# EAGLE design openLRSngRX32 (EAGLE 6.4)
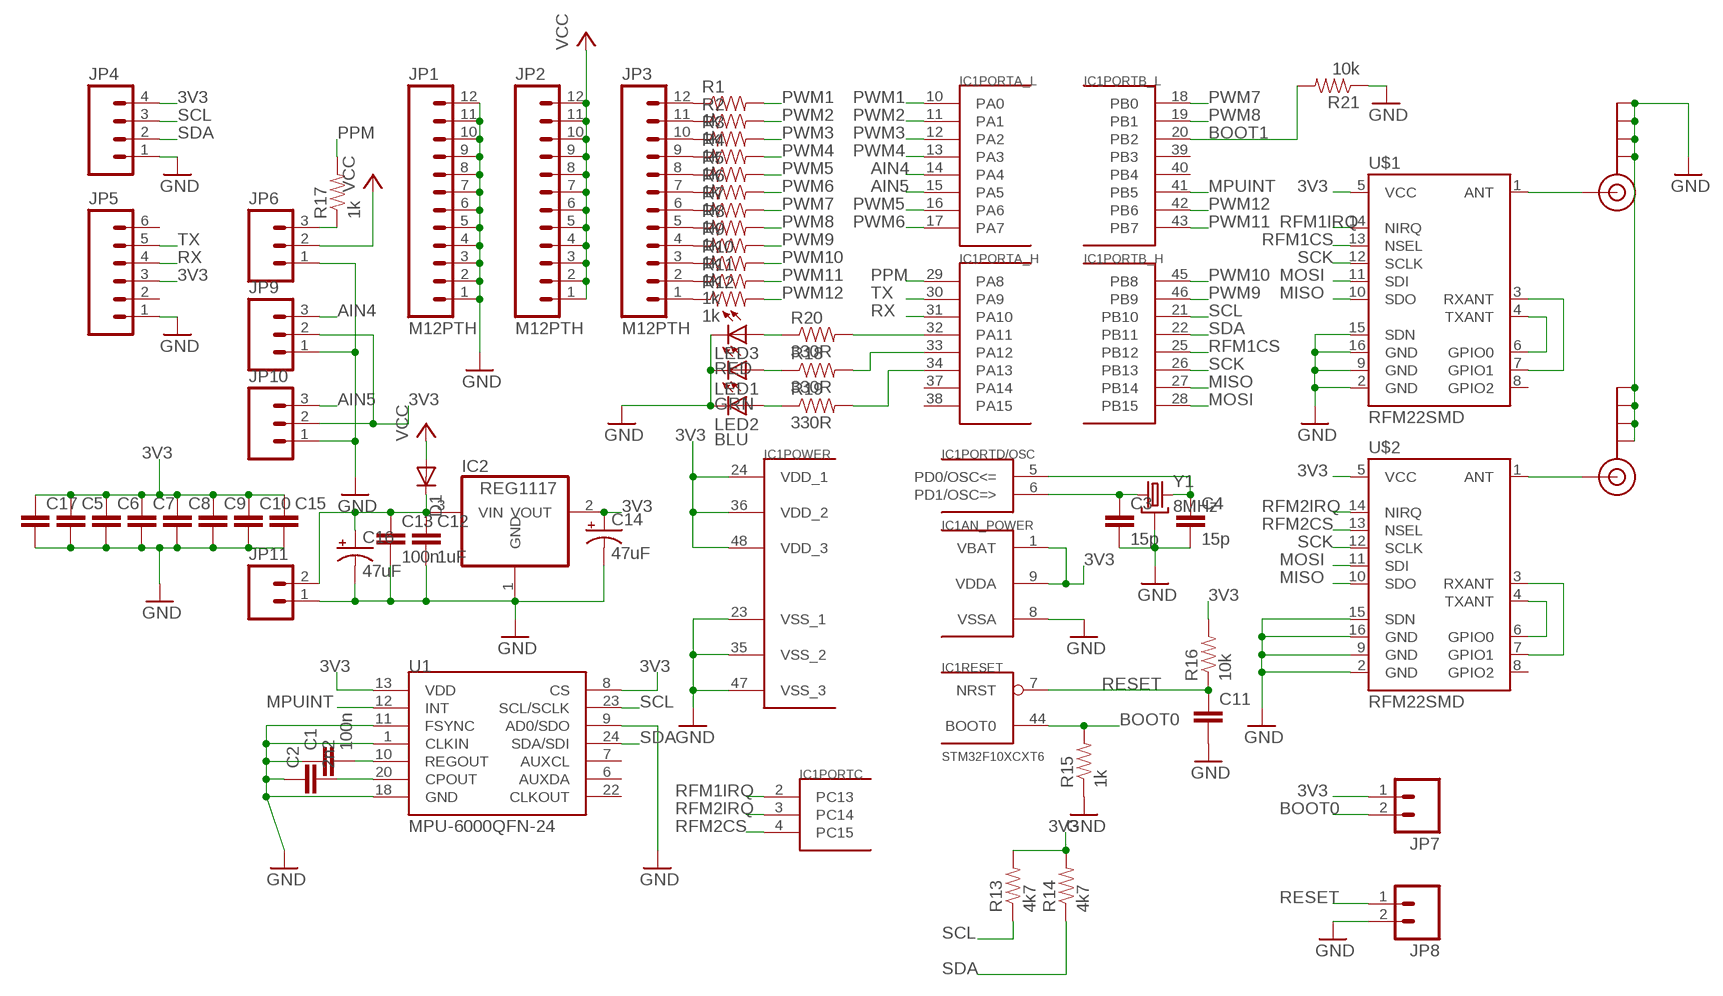
[diagram p0: schematic, sheet 1]

## Parts
C1  100n  CAP0805  [0805]
C2  2n2  CAP0805  [0805]
C3  15p  CAP0805  [0805]
C4  15p  CAP0805  [0805]
C5  CAP0805  [0805]
C6  CAP0805  [0805]
C7  CAP0805  [0805]
C8  CAP0805  [0805]
C9  CAP0805  [0805]
C10  CAP0805  [0805]
C11  CAP0805  [0805]
C12  1uF  CAP0805  [0805]
C13  100n  CAP0805  [0805]
C14  47uF  47UF-TANT  [EIA3528]
C15  CAP0805  [0805]
C16  47uF  47UF-TANT  [EIA3528]
C17  CAP0805  [0805]
D1  DIODE-DO-214AC  [DO-214AC]
IC1  STM32F10XCXT6  [TQFP48]
IC2  REG1117  [SOT223]
J$1  SMA_EDGE  [SMA-EDGE]
J$2  SMA_EDGE  [SMA-EDGE]
JP1  M12PTH  [1X12]
JP2  M12PTH  [1X12]
JP3  M12PTH  [1X12]
JP4  M04PTH  [1X04]
JP5  M06SIP  [1X06]
JP6  M03PTH  [1X03]
JP7  M02PTH  [1X02]
JP8  M02PTH  [1X02]
JP9  M03PTH  [1X03]
JP10  M03PTH  [1X03]
JP11  M02PTH  [1X02]
LED1  GRN  LEDSML0805  [SML0805]
LED2  BLU  LEDSML0805  [SML0805]
LED3  RED  LEDSML0805  [SML0805]
R1  1k  RESISTOR0805-RES  [0805]
R2  1k  RESISTOR0805-RES  [0805]
R3  1k  RESISTOR0805-RES  [0805]
R4  1k  RESISTOR0805-RES  [0805]
R5  1k  RESISTOR0805-RES  [0805]
R6  1k  RESISTOR0805-RES  [0805]
R7  1k  RESISTOR0805-RES  [0805]
R8  1k  RESISTOR0805-RES  [0805]
R9  1k  RESISTOR0805-RES  [0805]
R10  1k  RESISTOR0805-RES  [0805]
R11  1k  RESISTOR0805-RES  [0805]
R12  1k  RESISTOR0805-RES  [0805]
R13  4k7  RESISTOR0805-RES  [0805]
R14  4k7  RESISTOR0805-RES  [0805]
R15  1k  RESISTOR0805-RES  [0805]
R16  10k  RESISTOR0805-RES  [0805]
R17  1k  RESISTOR0805-RES  [0805]
R18  330R  RESISTOR0805-RES  [0805]
R19  330R  RESISTOR0805-RES  [0805]
R20  330R  RESISTOR0805-RES  [0805]
R21  10k  RESISTOR0805-RES  [0805]
U1  MPU-6000QFN-24  [QFN-24-TESTING]
U$1  RFM22SMD  [RFM22-XXX-S2]
U$2  RFM22SMD  [RFM22-XXX-S2]
Y1  8MHz  CRYSTAL3.2X2.5  [CRYSTAL-SMD-5X3]

## Nets
3V3: C5.1 C6.1 C7.1 C8.1 C9.1 C10.1 C14.A(+) C15.1 C17.1 IC1.1(AN_POWER:VBAT) IC1.9(AN_POWER:VDDA) IC1.24(POWER:VDD_1) IC1.36(POWER:VDD_2) IC1.48(POWER:VDD_3) IC2.2(VOUT) JP4.4 JP5.3 JP7.1 JP9.2 JP10.2 R13.2 R14.2 R16.2 U1.8(CS) U1.13(VDD) U$1.5(VCC) U$2.5(VCC)
AIN4: IC1.14(PORTA_L:PA4) JP9.3
AIN5: IC1.15(PORTA_L:PA5) JP10.3
BOOT0: IC1.44(RESET:BOOT0) JP7.2 R15.2
BOOT1: IC1.20(PORTB_L:PB2) R21.2
GND: C1.1 C2.1 C3.2 C4.2 C5.2 C6.2 C7.2 C8.2 C9.2 C10.2 C11.2 C12.2 C13.2 C14.C(-) C15.2 C16.C(-) C17.2 IC1.8(AN_POWER:VSSA) IC1.23(POWER:VSS_1) IC1.35(POWER:VSS_2) IC1.47(POWER:VSS_3) IC2.1(GND) J$1.GND@0(GND) J$1.GND@1(GND) J$1.GND@2(GND) J$1.GND@3(GND) J$2.GND@0(GND) J$2.GND@1(GND) J$2.GND@2(GND) J$2.GND@3(GND) JP1.1 JP1.2 JP1.3 JP1.4 JP1.5 JP1.6 JP1.7 JP1.8 JP1.9 JP1.10 JP1.11 JP1.12 JP4.1 JP5.1 JP6.1 JP8.2 JP9.1 JP10.1 JP11.1 LED1.C LED2.C LED3.C R15.1 R21.1 U1.1(CLKIN) U1.9(AD0/SDO) U1.11(FSYNC) U1.18(GND) U$1.2(GND) U$1.9(GND) U$1.15(SDN) U$1.16(GND) U$2.2(GND) U$2.9(GND) U$2.15(SDN) U$2.16(GND) Y1.2(GND) Y1.4(GND)
MISO: IC1.27(PORTB_H:PB14) U$1.10(SDO) U$2.10(SDO)
MOSI: IC1.28(PORTB_H:PB15) U$1.11(SDI) U$2.11(SDI)
MPUINT: IC1.41(PORTB_L:PB5) U1.12(INT)
N$1: JP3.12 R1.1
N$2: JP3.11 R2.1
N$3: JP3.10 R3.1
N$4: JP3.9 R4.1
N$5: JP3.8 R5.1
N$6: JP3.7 R6.1
N$7: JP3.6 R7.1
N$8: JP3.5 R8.1
N$9: JP3.4 R9.1
N$10: JP3.3 R10.1
N$11: JP3.2 R11.1
N$12: JP3.1 R12.1
N$13: J$2.SIG(SIGNAL) U$2.1(ANT)
N$14: C1.2 U1.10(REGOUT)
N$15: C2.2 U1.20(CPOUT)
N$16: C4.1 IC1.5(PORTD/OSC:PD0/OSC<=) Y1.3
N$17: C3.1 IC1.6(PORTD/OSC:PD1/OSC=>) Y1.1
N$18: J$1.SIG(SIGNAL) U$1.1(ANT)
N$19: U$2.4(TXANT) U$2.6(GPIO0)
N$20: U$2.3(RXANT) U$2.7(GPIO1)
N$23: U$1.4(TXANT) U$1.6(GPIO0)
N$24: U$1.3(RXANT) U$1.7(GPIO1)
N$25: JP6.3 R17.1
N$28: C12.1 C13.1 C16.A(+) D1.C IC2.3(VIN) JP11.2
N$30: LED3.A R20.1
N$31: LED1.A R18.1
N$32: LED2.A R19.1
N$33: IC1.32(PORTA_H:PA11) R20.2
N$34: IC1.33(PORTA_H:PA12) R18.2
N$35: IC1.34(PORTA_H:PA13) R19.2
PPM: IC1.29(PORTA_H:PA8) R17.2
PWM1: IC1.10(PORTA_L:PA0) R1.2
PWM2: IC1.11(PORTA_L:PA1) R2.2
PWM3: IC1.12(PORTA_L:PA2) R3.2
PWM4: IC1.13(PORTA_L:PA3) R4.2
PWM5: IC1.16(PORTA_L:PA6) R5.2
PWM6: IC1.17(PORTA_L:PA7) R6.2
PWM7: IC1.18(PORTB_L:PB0) R7.2
PWM8: IC1.19(PORTB_L:PB1) R8.2
PWM9: IC1.46(PORTB_H:PB9) R9.2
PWM10: IC1.45(PORTB_H:PB8) R10.2
PWM11: IC1.43(PORTB_L:PB7) R11.2
PWM12: IC1.42(PORTB_L:PB6) R12.2
RESET: C11.1 IC1.7(RESET:NRST) JP8.1 R16.1
RFM1CS: IC1.25(PORTB_H:PB12) U$1.13(NSEL)
RFM1IRQ: IC1.2(PORTC:PC13) U$1.14(NIRQ)
RFM2CS: IC1.4(PORTC:PC15) U$2.13(NSEL)
RFM2IRQ: IC1.3(PORTC:PC14) U$2.14(NIRQ)
RX: IC1.31(PORTA_H:PA10) JP5.4
SCK: IC1.26(PORTB_H:PB13) U$1.12(SCLK) U$2.12(SCLK)
SCL: IC1.21(PORTB_H:PB10) JP4.3 R13.1 U1.23(SCL/SCLK)
SDA: IC1.22(PORTB_H:PB11) JP4.2 R14.1 U1.24(SDA/SDI)
TX: IC1.30(PORTA_H:PA9) JP5.5
VCC: D1.A JP2.1 JP2.2 JP2.3 JP2.4 JP2.5 JP2.6 JP2.7 JP2.8 JP2.9 JP2.10 JP2.11 JP2.12 JP6.2
Unconnected: IC1.37(PORTA_H:PA14) IC1.38(PORTA_H:PA15) IC1.39(PORTB_L:PB3) IC1.40(PORTB_L:PB4) JP5.2 JP5.6 U1.6(AUXDA) U1.7(AUXCL) U1.22(CLKOUT) U$1.8(GPIO2) U$2.8(GPIO2)

## Library data of the parts
C1-C13 C15 C17 = SparkFun-Capacitors:CAP: Capacitor Standard 0603 ceramic capacitor, and 0.1" leaded capacitor.
C14 C16 = SparkFun-Capacitors:47UF-TANT: 47uF Tantalum SMT CAP-08310- 10V 10% (EIA-3528); PROD_ID: CAP-08310
D1 = diode:DIODE-: DIODE
IC1 = stm32:STM32F10XCXT6: ST STM32F101/103 48pin LQFP
IC2 = burr-brown:REG1117: 800mA and 1A Low Dropout (LDO) Positive Regulator 1.8V, 2.5V, 2.85V, 3.3V, 5V, and Adj; MPN: REG1117; OC_FARNELL: 1097566; OC_NEWARK: 14P6981
J$1 J$2 = SparkFun-Connectors:SMA_EDGE: SMA Antenna Connector End launch SMA connector. The paste layer has been removed so that the connector can be hand soldered onto the board after reflow.
JP1-JP3 = SparkFun-Connectors:M12: Header 12 Standard 12-pin 0.1" header. Use with straight break away headers (SKU : PRT-00116), right angle break away headers (PRT-00553), swiss pins (PRT-00743), machine pins (PRT-00117), and female headers (PRT-00115).
JP4 = SparkFun-Connectors:M04: Header 4 Standard 4-pin 0.1" header. Use with straight break away headers (SKU : PRT-00116), right angle break away headers (PRT-00553), swiss pins (PRT-00743), machine pins (PRT-00117), and female headers (PRT-00115). Molex polarized connector foot print use with SKU : PRT-08231 with associated crimp pins and housings. 1MM SMD Version SKU: PRT-10208
JP5 = SparkFun-Connectors:M06: Header 6 Standard 6-pin 0.1" header. Use with straight break away headers (SKU : PRT-00116), right angle break away headers (PRT-00553), swiss pins (PRT-00743), machine pins (PRT-00117), and female headers (PRT-00115). Molex polarized connector foot print use with SKU : PRT-08094 with associated crimp pins and housings. NOTES ON THE VARIANTS LOCK and LOCK_LONGPADS... This footprint was designed to help hold the alignment of a through-hole component (i.e. 6-pin header) while soldering it into place. You may notice that each hole has been shifted either up or down by 0.005 of an inch from it's more standard position (which is a perfectly straight line). This slight alteration caused the pins (the squares in the middle) to touch the edges of the holes. Because they are alternating, it causes a "brace" to hold the component in place. 0.005 has proven to be the perfect amount of "off-center" position when using our standard breakaway headers. Although looks a little odd when you look at the bare footprint, once you have a header in there, the alteration is very hard to notice. Also, if you push a header all the way into place, it is covered up entirely on the bottom side. This idea of altering the position of holes to aid alignment will be further integrated into the Sparkfun Library for other footprints. It can help hold any component with 3 or more connection pins.
JP6 JP9 JP10 = SparkFun-Connectors:M03: Header 3 Standard 3-pin 0.1" header. Use with straight break away headers (SKU : PRT-00116), right angle break away headers (PRT-00553), swiss pins (PRT-00743), machine pins (PRT-00117), and female headers (PRT-00115). Molex polarized connector foot print use with SKU : PRT-08232 with associated crimp pins and housings.
JP7 JP8 JP11 = SparkFun-Connectors:M02: Header 2 Standard 2-pin 0.1" header. Use with straight break away headers (SKU : PRT-00116), right angle break away headers (PRT-00553), swiss pins (PRT-00743), machine pins (PRT-00117), and female headers (PRT-00115). Molex polarized connector foot print use with SKU : PRT-08233 with associated crimp pins and housings.
LED1-LED3 = led:LED: LED OSRAM: - CHIPLED LG R971, LG N971, LY N971, LG Q971, LY Q971, LO R971, LY R971 LH N974, LH R974 LS Q976, LO Q976, LY Q976 LO Q996 - Hyper CHIPLED LW Q18S LB Q993, LB Q99A, LB R99A - SideLED LS A670, LO A670, LY A670, LG A670, LP A670 LB A673, LV A673, LT A673, LW A673 LH A674 LY A675 LS A676, LA A676, LO A676, LY A676, LW A676 LS A679, LY A679, LG A679 - Hyper Micro SIDELED® LS Y876, LA Y876, LO Y876, LY Y876 LT Y87S - SmartLED LW L88C, LW L88S LB L89C, LB L89S, LG L890 LS L89K, LO L89K, LY L89K LS L896, LA L896, LO L896, LY L896 - TOPLED LS T670, LO T670, LY T670, LG T670, LP T670 LSG T670, LSP T670, LSY T670, LOP T670, LYG T670 LG T671, LOG T671, LSG T671 LB T673, LV T673, LT T673, LW T673 LH T674 LS T676, LA T676, LO T676, LY T676, LB T676, LH T676, LSB T676, LW T676 LB T67C, LV T67C, LT T67C, LS T67K, LO T67K, LY T67K, LW E67C LS E67B, LA E67B, LO E67B, LY E67B, LB E67C, LV E67C, LT E67C LW T67C LS T679, LY T679, LG T679 LS T770, LO T770, LY T770, LG T770, LP T770 LB T773, LV T773, LT T773, LW T773 LH T774 LS E675, LA E675, LY E675, LS T675 LS T776, LA T776, LO T776, LY T776, LB T776 LHGB T686 LT T68C, LB T68C - Hyper Mini TOPLED® LB M676 - Mini TOPLED Santana® LG M470 LS M47K, LO M47K, LY M47K Source: http://www.osram.convergy.de LUXEON: - LUMILED® LXK2-PW12-R00, LXK2-PW12-S00, LXK2-PW14-U00, LXK2-PW14-V00 LXK2-PM12-R00, LXK2-PM12-S00, LXK2-PM14-U00 LXK2-PE12-Q00, LXK2-PE12-R00, LXK2-PE12-S00, LXK2-PE14-T00, LXK2-PE14-U00 LXK2-PB12-K00, LXK2-PB12-L00, LXK2-PB12-M00, LXK2-PB14-N00, LXK2-PB14-P00, LXK2-PB14-Q00 LXK2-PR12-L00, LXK2-PR12-M00, LXK2-PR14-Q00, LXK2-PR14-R00 LXK2-PD12-Q00, LXK2-PD12-R00, LXK2-PD12-S00 LXK2-PH12-R00, LXK2-PH12-S00 LXK2-PL12-P00, LXK2-PL12-Q00, LXK2-PL12-R00 Source: www.luxeon.com KINGBRIGHT: KA-3528ASYC Source: www.kingbright.com
R1-R21 = SparkFun-Resistors:RESISTOR: Resistor Basic schematic elements and footprints for 0603, 1206, and PTH resistors.
U1 = SparkFun-Sensors:MPU-6000: MPU-6000 - I2C address is 0x68 with AD0 low and 0x69 with AD0 high.
U$1 U$2 = SparkFun-RF:RFM22: The RFM22 is a low-power, low cost radio that is capable of operating in the 434MHz and 900MHz open bands. It's frequency is software defined and there are some very good libraries written for it.
Y1 = crystal_3225:CRYSTAL: Various standard crystals. Proven footprints. Spark Fun Electronics SKU : COM-00534

## Board
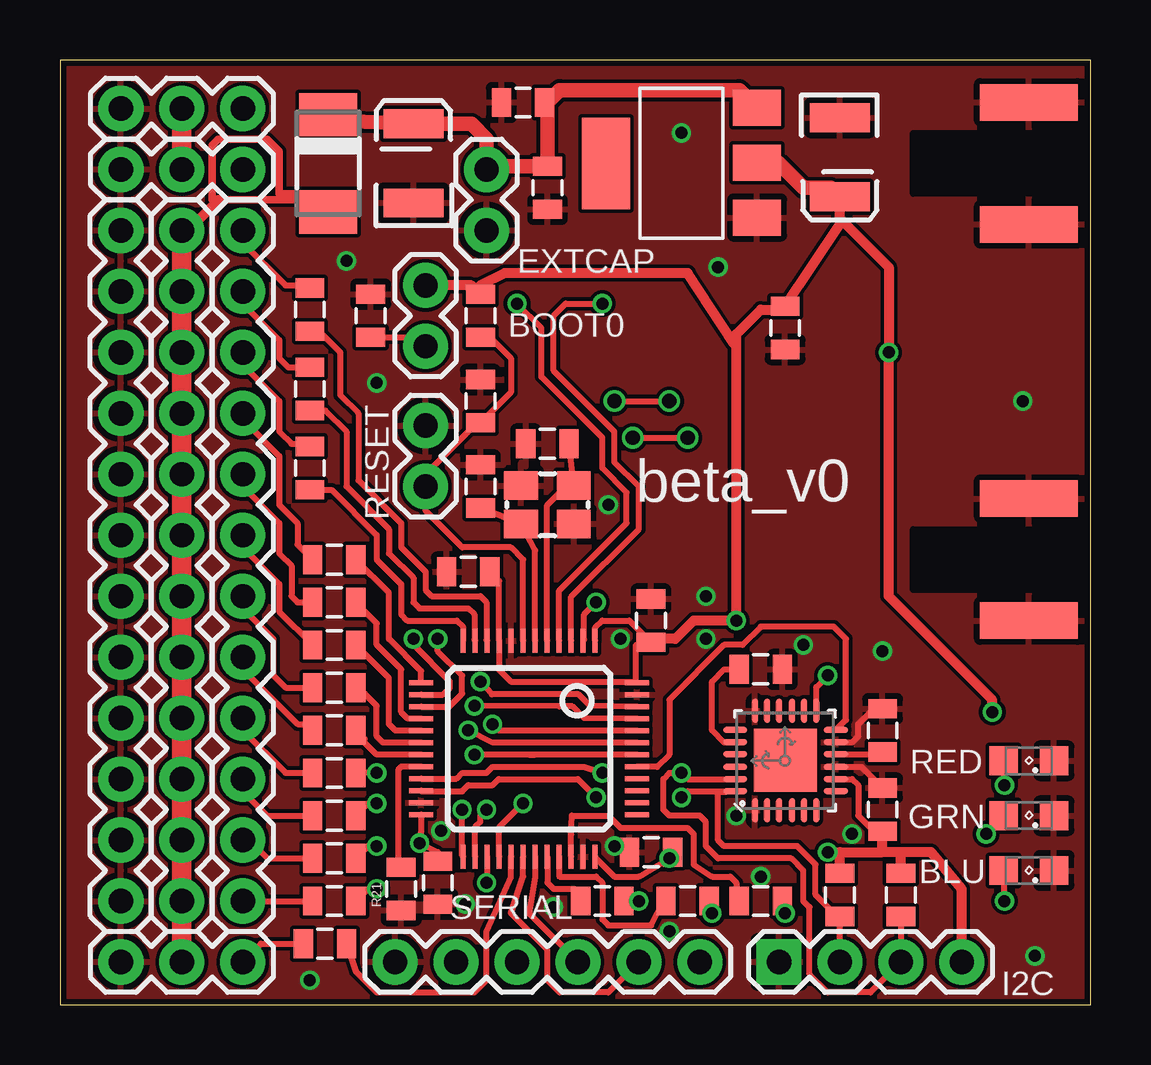
[diagram p1: board, top side]
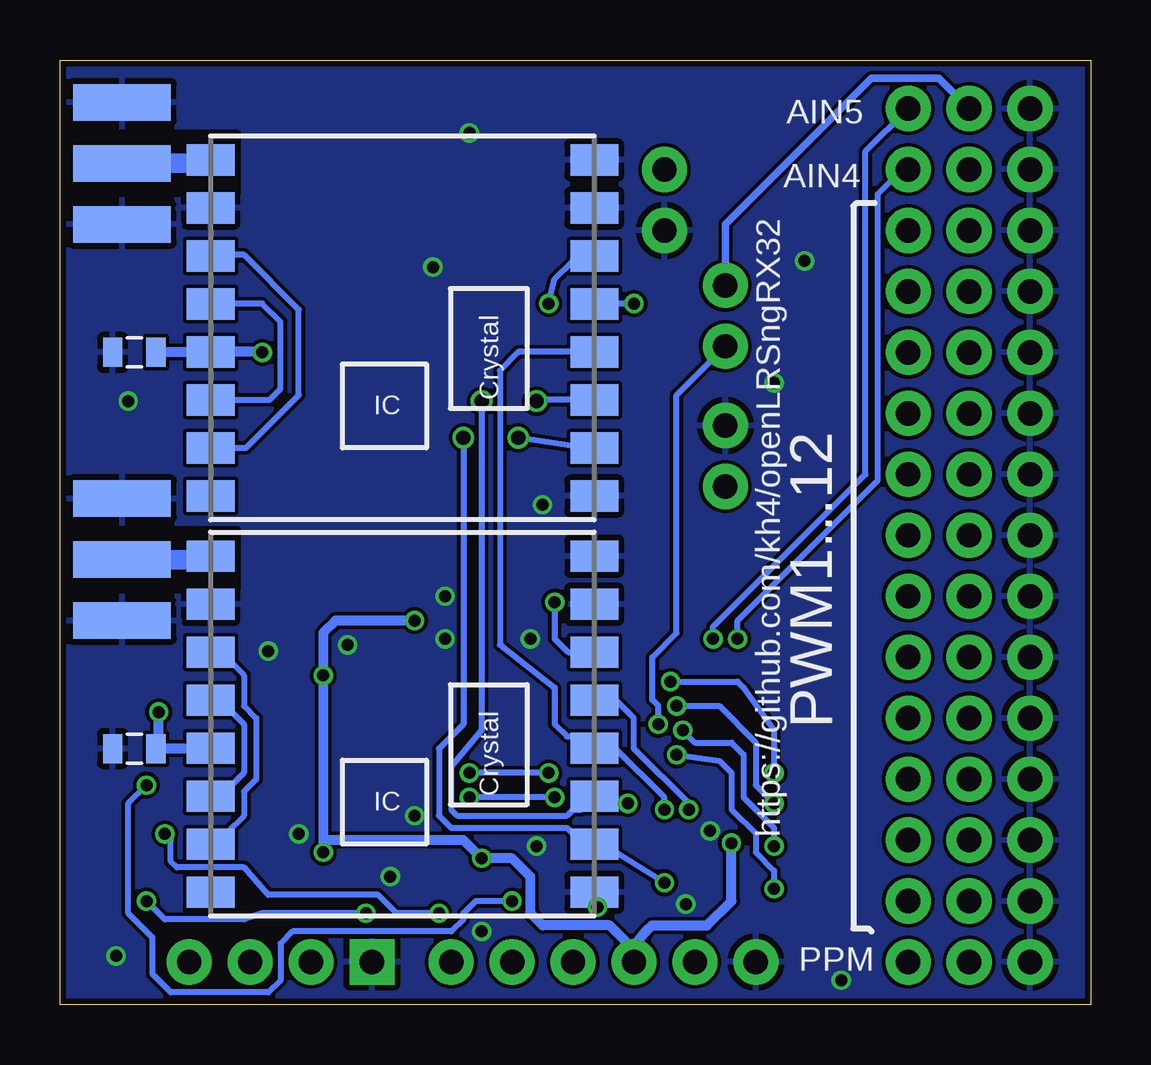
[diagram p2: board, bottom side, seen from below]

Size 42.98 x 39.36 mm. Coordinates in mm from the lower left corner, seen from the top.
Outline: 0,0 42.98,0 42.98,39.36 0,39.36 0,0
Copper layers (1*16): Top 0.035mm / dielectric 1.5mm / Bottom 0.035mm
Design rules "ITEADstudio_DRC": minimum track width 6mil, minimum drill 12mil, track to track 6mil, track to pad 6mil, pad to pad 6mil, via to via 6mil, smd to smd 0mil, copper to edge 10mil, drill to drill 10mil, minimum pad ring 10mil, minimum via ring 6mil, stop-mask expansion 2mil, vias tented up to drill 100mil, thermal gap 10mil

### Footprints (pad centres in the part's own frame; a part is rotated, then mirrored left to right if it is on the bottom)
0805 = smd 0.8 x 1.2: 1 -0.9,0; 2 0.9,0
EIA3528 = smd 1.2 x 2.5: A 1.65,0; C -1.65,0
DO-214AC = smd 1.8 x 2.4: A 2.025,0; C -2.025,0
TQFP48 = smd 0.2 x 1: 1 -2.75,-4.5; 2 -2.25,-4.5; 3 -1.75,-4.5; 4 -1.25,-4.5; 5 -0.75,-4.5; 6 -0.25,-4.5; 7 0.25,-4.5; 8 0.75,-4.5; 9 1.25,-4.5; 10 1.75,-4.5; 11 2.25,-4.5; 12 2.75,-4.5; 25 2.75,4.5; 26 2.25,4.5; 27 1.75,4.5; 28 1.25,4.5; 29 0.75,4.5; 30 0.25,4.5; 31 -0.25,4.5; 32 -0.75,4.5; 33 -1.25,4.5; 34 -1.75,4.5; 35 -2.25,4.5; 36 -2.75,4.5 | smd 1 x 0.2: 13 4.5,-2.75; 14 4.5,-2.25; 15 4.5,-1.75; 16 4.5,-1.25; 17 4.5,-0.75; 18 4.5,-0.25; 19 4.5,0.25; 20 4.5,0.75; 21 4.5,1.25; 22 4.5,1.75; 23 4.5,2.25; 24 4.5,2.75; 37 -4.5,2.75; 38 -4.5,2.25; 39 -4.5,1.75; 40 -4.5,1.25; 41 -4.5,0.75; 42 -4.5,0.25; 43 -4.5,-0.25; 44 -4.5,-0.75; 45 -4.5,-1.25; 46 -4.5,-1.75; 47 -4.5,-2.25; 48 -4.5,-2.75
SOT223 = smd 1.499 x 2.007: 1 -2.261,-3.15; 2 0.025,-3.15; 3 2.311,-3.15 | smd 3.81 x 2.007: 4 0,3.15
SMA-EDGE = smd 1.524 x 4.064: GND@0 0,0; GND@1 5.08,0; SIG 2.54,0 | smd 1.524 x 4.064 bottom: GND@2 0,0; GND@3 5.08,0
1X12 = drill 1.016 pad 1.88: 1 0,0; 2 2.54,0; 3 5.08,0; 4 7.62,0; 5 10.16,0; 6 12.7,0; 7 15.24,0; 8 17.78,0; 9 20.32,0; 10 22.86,0; 11 25.4,0; 12 27.94,0
1X04 = drill 1.016 pad 1.88 square: 1 0,0 | drill 1.016 pad 1.88: 2 2.54,0; 3 5.08,0; 4 7.62,0
1X06 = drill 1.016 pad 1.88: 1 0,0; 2 2.54,0; 3 5.08,0; 4 7.62,0; 5 10.16,0; 6 12.7,0
1X03 = drill 1.016 pad 1.88: 1 0,0; 2 2.54,0; 3 5.08,0
1X02 = drill 1.016 pad 1.88: 1 0,0; 2 2.54,0
SML0805 = smd 1.2 x 1.2: A 1.05,0; C -1.05,0
QFN-24-TESTING = smd 1.016 x 0.254: 1 -2.066,1.257; 2 -2.066,0.75; 3 -2.066,0.247; 4 -2.066,-0.287; 5 -2.066,-0.792; 6 -2.066,-1.297; 13 2.086,-1.297; 14 2.086,-0.792; 15 2.086,-0.287; 16 2.086,0.247; 17 2.086,0.75; 18 2.086,1.257 | smd 0.254 x 1.016: 7 -1.267,-2.122; 8 -0.762,-2.122; 9 -0.258,-2.122; 10 0.278,-2.122; 11 0.78,-2.122; 12 1.287,-2.122; 19 1.287,2.082; 20 0.78,2.082; 21 0.278,2.082; 22 -0.258,2.082; 23 -0.762,2.082; 24 -1.267,2.082 | smd 2.616 x 2.616: P$1 0.02,-0.01
RFM22-XXX-S2 = smd 2 x 1.3: 1 -8,7; 2 -8,5; 3 -8,3; 4 -8,1; 5 -8,-1; 6 -8,-3; 7 -8,-5; 8 -8,-7; 9 8,-7; 10 8,-5; 11 8,-3; 12 8,-1; 13 8,1; 14 8,3; 15 8,5; 16 8,7
CRYSTAL-SMD-5X3 = smd 1.4 x 1.2: 1 -1.1,-0.8; 2 1.1,-0.8; 3 1.1,0.8; 4 -1.1,0.8

### Placement (x,y rotation side)
C1  34.29,11.43 270 top
C2  29.21,13.97 180 top
C3  17.53,21.59 90 top
C4  20.32,23.37 180 top
C5  24.64,6.35 180 top
C6  17.02,18.03 180 top
C7  15.75,5.08 270 top
C8  34.29,8.13 90 top
C9  39.88,10.67 180 bottom
C10  24.64,16 90 top
C11  17.53,25.15 90 top
C12  20.32,34.04 270 top
C13  19.3,37.59 180 top
C14  32.51,35.31 270 top
C15  39.88,27.18 180 bottom
C16  14.73,35.05 90 top
C17  30.23,28.19 270 top
D1  11.18,35.05 270 top
IC1  19.56,10.67 180 top
IC2  25.91,35.05 90 top
J$1  40.39,16 90 bottom
J$2  40.39,32.51 90 bottom
JP1  2.54,4.32 90 top
JP2  5.08,4.32 90 top
JP3  7.62,4.32 90 top
JP4  29.97,1.78 0 top
JP5  13.97,1.78 0 top
JP6  2.54,1.78 0 top
JP7  15.24,29.97 270 top
JP8  15.24,21.59 90 top
JP9  2.54,34.8 0 top
JP10  2.54,37.34 0 top
JP11  17.78,32.26 90 top
LED1  40.39,7.87 180 top
LED2  40.39,5.59 180 top
LED3  40.39,10.16 180 top
R1  10.41,28.96 270 top
R2  10.41,25.65 270 top
R3  10.41,22.35 270 top
R4  11.43,18.54 0 top
R5  11.43,16.76 0 top
R6  11.43,14.99 0 top
R7  11.43,13.21 0 top
R8  11.43,11.43 0 top
R9  11.43,9.65 0 top
R10  11.43,7.87 0 top
R11  11.43,6.1 0 top
R12  11.43,4.32 0 top
R13  35.05,4.57 90 top
R14  32.51,4.57 90 top
R15  12.95,28.7 270 top
R16  17.53,28.7 90 top
R17  11.05,2.54 0 top
R18  26.16,4.32 180 top
R19  29.21,4.32 180 top
R20  22.61,4.32 180 top
R21  14.22,4.83 90 top
U1  30.23,10.16 90 top
U$1  28.7,11.68 0 bottom
U$2  28.7,28.19 0 bottom
Y1  20.32,20.83 0 top

### Tracks (layer width: path | path; a pad name or v marks a point on that pad's centre or on a via)
3V3  (via drill 0.5)
  Top 0.254: C6.1 18.31,17.64 IC1.9 18.31,13.95 18.8,13.46 24.01,13.46 | U1.8 33.02,9.4 | 33.02,9.4 | 33.02,9.4 33.27,9.14 33.27,7.87 33.78,7.37 34.15,7.37 C8.1 | IC1.24 15.06,7.29 v14.99,6.73 15.75,6.35 C7.1 | 24.01,13.46 IC1.48 | U1.13 31.52,13.23 v32,13.72 | 24.01,13.46 24.01,14.99 C10.1 23.74,16 22.61,16 22.31,15.7 IC1.1 | IC1.36 22.31,6.14 23.11,5.33 24.13,5.33 v25.4,6.1 25.4,6.21 C5.1
  Top 0.406: JP4.4 37.59,4.83 36.32,6.35 35.05,6.35 | 35.05,6.35 34.29,6.35 | 34.29,6.35 C8.1 | 32.64,32.64 32.51,32.77 C14.A | 32.64,32.64 34.54,30.73 v34.54,27.18 34.54,17.02 38.86,12.7 v38.86,12.19 | JP7.1 17.16,29.97 R16.2 17.53,29.97 18.54,30.48 26.16,30.48 28.07,27.56 28.19,27.43 | v32,6.35 32.51,6.35 | 32.51,6.35 34.29,6.35 | 28.19,27.43 v28.19,16 26.42,16 25.65,15.24 24.27,15.24 C10.1 | R13.2 35.05,6.35 | R14.2 32.51,6.35 | 32.64,32.64 32.51,32.51 C17.1 30.09,28.96 29.21,28.96 28.19,27.94 28.19,27.43
  Top 0.61: IC2.2 29.95,35.08 30.99,34.04 32.13,34.04 C14.A
  Top 0.813: JP9.2 JP10.2
  Bottom 0.305: JP7.1 15.24,32.51 9.14,38.61 6.35,38.61 JP10.2
  Bottom 0.406: JP5.3 19.05,2.29 | 19.05,2.29 20.07,3.3 22.86,3.3 23.37,3.81 23.37,5.33 24.13,6.1 v25.4,6.1 26.16,6.86 32,6.86 | 19.05,2.29 19.05,2.42 18.54,3.05 18.29,3.3 16,3.3 14.99,4.32 v14.99,6.73 | C9.1 39.02,10.68 U$1.5 36.72,10.67 39.12,10.67 39.12,10.41 38.86,10.41 v38.86,12.19 | C15.1 39.02,27.19 U$2.5 34.56,27.19 v34.54,27.18 | 32,6.86 v32,13.72 32,15.49 31.5,16 v28.19,16 | 32,6.86 v32,6.35
AIN4  (via drill 0.5)
  Top 0.254: IC1.14 15.97,12.92 16.26,13.21 16.26,13.46 14.73,14.99 v14.73,15.24
  Bottom 0.254: v14.73,15.24 14.73,16 8.89,21.84 8.89,33.78 7.87,34.8 JP9.3
AIN5  (via drill 0.5)
  Top 0.254: IC1.15 16.23,12.42 16.76,12.95 16.76,13.72 15.75,14.73 v15.75,15.24
  Bottom 0.254: v15.75,15.24 15.75,15.75 9.4,22.1 9.4,35.56 JP10.3
BOOT0  (via drill 0.5)
  Top 0.254: R15.2 14.87,27.8 arc-90 JP7.2 | IC1.44 18.3,11.42 v18.03,11.68
  Bottom 0.254: v18.03,11.68 18.03,12.45 18.29,12.7 18.29,14.48 17.27,15.49 17.27,25.4 JP7.2
BOOT1
  Top 0.254: IC1.20 14.22,9.92 14.22,9.91 14.1,9.78 14.1,5.73 R21.2
GND  (via drill 0.5)
  Top 0.254: U1.9 33.42,9.9 C8.2 | U1.11 33.04,10.94 33.27,11.18 33.27,11.68 33.78,12.19 34.15,12.19 C1.1
  Bottom 0.254: v20.57,4.06 20.57,4.56 U$1.9
  other vias: 28.19,7.87 33.02,7.11 11.94,30.99 13.21,25.91 26.92,15.24 30.99,14.99 26.92,17.02 22.86,20.83 34.29,14.73 40.13,25.15 40.64,2.03 25.91,36.32 27.43,30.73 10.41,1.02 23.37,15.24 29.21,5.33 25.4,3.05 23.11,6.6 16.89,4.19 15.88,7.24
  pour Top: 0,0 42.93,0 42.93,39.62 0,39.62
  pour Bottom: 0,0 42.93,0 42.93,39.62 0,39.62
MISO  (via drill 0.5, 0.6)
  Top 0.254: IC1.27 17.81,5.31 v17.78,5.08 | v23.88,23.62 v26.16,23.62
  Bottom 0.254: v17.78,5.08 19.81,6.35 20.37,6.35 U$1.10 21.13,7.11 21.59,7.11 21.84,7.37 26.67,7.37 27.18,7.87 27.18,10.67 26.16,11.68 v26.16,23.62 | U$2.10 20.65,23.19 20.57,23.11 v23.88,23.62
MOSI  (via drill 0.5, 0.6)
  Top 0.254: IC1.28 18.31,7.39 v19.3,8.38 | v23.11,25.15 v25.4,25.15
  Bottom 0.254: v19.3,8.38 20.65,8.64 U$1.11 21.26,8.13 21.59,8.13 21.84,7.87 26.42,7.87 26.67,8.13 26.67,9.91 25.4,11.43 v25.4,25.15 | U$2.11 23.07,25.19
  Bottom 0.406: 23.07,25.19 v23.11,25.15
MPUINT
  Top 0.254: U1.12 32.77,11.87 32.77,15.24 32.26,15.75 29.21,15.75 28.45,14.99 27.69,14.99 25.4,12.7 25.4,10.41 24.89,9.91 24.88,9.92 IC1.41
N$1
  Top 0.254: JP3.12 7.62,31.75 9.4,29.97 10.3,29.97 R1.1
N$2
  Top 0.254: JP3.11 7.62,29.21 9.14,27.69 9.14,26.92 9.51,26.55 R2.1
N$3
  Top 0.254: JP3.10 7.62,26.67 9.14,25.15 9.14,23.88 9.65,23.37 10.3,23.37 R3.1
N$4
  Top 0.254: JP3.9 7.62,24.38 9.14,22.86 9.14,20.83 9.91,20.07 9.91,19.17 R4.1
N$5
  Top 0.254: JP3.8 7.62,21.59 9.14,20.07 9.14,18.8 9.65,18.29 9.65,17.02 9.91,16.76 R5.1
N$6
  Top 0.254: JP3.7 7.62,19.05 9.14,17.53 9.14,16.37 R6.1
N$7
  Top 0.254: JP3.6 7.62,16.51 8.89,15.24 8.89,13.72 9.4,13.21 R7.1
N$8
  Top 0.254: JP3.5 7.62,13.97 9.91,11.68 10.28,11.68 R8.1
N$9
  Top 0.254: JP3.4 7.62,11.43 9.4,9.65 R9.1
N$10
  Top 0.254: JP3.3 7.62,8.89 8.64,7.87 R10.1
N$11
  Top 0.254: JP3.2 7.87,6.86 8.64,6.1 R11.1
N$12
  Top 0.254: JP3.1 R12.1
N$13
  Bottom 0.813: J$2.SIG 36.84,35.05 U$2.1
N$14
  Top 0.254: U1.10 33.94,10.44 arc90 C1.2
N$15
  Top 0.254: U1.20 28.13,10.92 27.69,10.92 27.18,11.43 27.18,13.46 27.69,13.97 C2.2
N$16
  Top 0.254: IC1.5 20.31,20.82 20.83,21.34 21.38,21.34 Y1.3 C4.1
N$17
  Top 0.254: IC1.6 19.81,18.93 Y1.1 C3.1
N$18
  Bottom 0.813: J$1.SIG 36.84,18.54 U$1.1
N$19
  Bottom 0.254: U$2.6 34.24,25.19 33.78,25.65 33.78,28.45 34.54,29.21 36.69,29.21 U$2.4
N$20
  Bottom 0.254: U$2.7 35.23,23.19 33.02,25.4 33.02,28.96 35.31,31.24 36.65,31.24 U$2.3
N$21
  cutout Top: 35.56,36.32 42.93,36.32 42.93,33.78 35.56,33.78
N$22
  cutout Top: 35.56,19.81 42.93,19.81 42.93,17.27 35.56,17.27
N$23
  Bottom 0.254: U$1.4 36.31,12.68 35.31,11.68 35.31,9.65 36.07,8.89 36.5,8.89 U$1.6
N$24
  Bottom 0.254: U$1.3 36.27,14.68 35.31,13.72 35.31,12.45 34.8,11.94 34.8,9.4 35.31,8.89 35.31,7.87 36.07,7.11 36.27,7.11 U$1.7
N$25
  Top 0.254: JP6.3 8.38,2.54 R17.1
N$26
  cutout Bottom: 35.56,19.81 42.93,19.81 42.93,17.27 35.56,17.27
N$27
  cutout Bottom: 35.56,36.32 42.93,36.32 42.93,33.78 35.56,33.78
N$28
  Top 0.61: D1.C 11.68,36.83 C16.A 17.15,36.7 17.78,36.07 JP11.2 17.92,34.94 C12.1 20.32,37.48 C13.1 20.32,37.59 20.83,38.1 28.32,38.1 IC2.3
N$30  (via drill 0.5)
  Top 0.254: R20.1 v24.13,4.32 | v39.37,9.14 39.37,10.13 LED3.A
  Bottom 0.254: v24.13,4.32 25.65,4.32 26.16,3.81 26.16,3.56 26.67,3.05 33.27,3.05 33.78,2.54 33.78,1.02 34.29,0.51 38.35,0.51 39.12,1.27 39.12,2.79 40.13,3.81 40.13,8.38 v39.37,9.14
N$31  (via drill 0.5)
  Top 0.254: R18.1 27.06,3.93 v27.18,3.81 | v38.61,7.11 38.61,7.15 LED1.A
  Bottom 0.254: v27.18,3.81 28.96,3.81 29.72,4.57 34.29,4.57 35.31,5.71 38.1,5.71 38.35,5.97 38.35,6.86 v38.61,7.11
N$32  (via drill 0.5)
  Top 0.254: R19.1 30.11,3.93 v30.23,3.81 | v39.37,4.32 39.37,5.11 LED2.A
  Bottom 0.254: v30.23,3.81 34.54,3.81 35.31,3.56 38.61,3.56 v39.37,4.32
N$33
  Top 0.254: IC1.32 20.32,5.08 20.57,4.83 21.45,4.83 R20.2
N$34
  Top 0.254: IC1.33 20.81,5.35 20.83,5.33 22.35,5.33 22.61,5.08 22.61,3.56 22.86,3.3 24.64,3.3 25.15,4.32 25.15,4.43 R18.2
N$35
  Top 0.254: IC1.34 21.31,7.08 21.34,7.87 22.86,7.87 23.37,7.37 26.16,7.37 26.42,7.11 26.42,5.84 27.18,5.33 27.94,5.33 28.19,5.08 28.19,4.43 R19.2
PPM
  Top 0.254: R17.2 12.33,1.39 13.21,0.51 17.27,0.51 17.78,1.02 17.78,3.05 18.8,5.33 18.8,6.16 IC1.29
PWM1
  Top 0.254: 10.55,28.06 R1.2 10.81,28.06 11.68,27.18 11.68,25.4 12.45,24.64 12.45,21.84 14.22,20.07 14.22,19.05 15.24,18.03 15.24,17.27 15.49,17.02 17.53,17.02 17.78,16.76 17.78,15.2 IC1.10
PWM2
  Top 0.254: R2.2 11.06,24.75 11.94,23.88 11.94,21.59 13.72,19.81 13.72,18.8 14.73,17.78 14.73,16.76 14.99,16.51 17.02,16.51 17.27,16.26 17.27,15.2 IC1.11
PWM3
  Top 0.254: R3.2 11.31,21.45 13.21,19.56 13.21,18.54 14.22,17.53 14.22,16.26 14.48,16 16.54,16 16.79,15.75 IC1.12
PWM4
  Top 0.254: IC1.13 15.06,13.9 13.72,15.24 13.72,17.16 R4.2
PWM5
  Top 0.254: IC1.16 14.5,11.92 14.22,12.19 14.22,13.97 13.21,14.99 13.21,15.89 R5.2
PWM6
  Top 0.254: IC1.17 13.98,11.42 13.72,11.68 13.72,13.6 R6.2
PWM7
  Top 0.254: IC1.18 13.47,10.92 13.21,11.18 13.21,12.45 12.7,12.95 12.58,12.95 R7.2
PWM8
  Top 0.254: IC1.19 13.2,10.42 12.7,10.92 12.7,11.06 R8.2
PWM9  (via drill 0.5)
  Top 0.254: IC1.46 22.1,12.45 21.62,12.93 18.01,12.93 v17.53,13.46 | v13.21,9.65 R9.2
  Bottom 0.254: v17.53,13.46 14.73,13.46 14.48,13.21 13.21,11.43 v13.21,9.65
PWM10  (via drill 0.5)
  Top 0.254: IC1.45 21.84,11.94 21.36,12.43 20.81,12.43 v17.27,12.45 | v13.21,8.38 12.84,8.38 R10.2
  Bottom 0.254: v17.27,12.45 15.49,12.45 13.97,10.92 13.97,9.14 v13.21,8.38
PWM11  (via drill 0.5)
  Top 0.254: IC1.43 18.04,10.92 v17.02,11.43 | v13.21,6.6 12.84,6.6 R11.2
  Bottom 0.254: v17.02,11.43 16.51,10.92 14.99,10.92 14.48,10.41 14.48,8.64 13.21,7.37 v13.21,6.6
PWM12  (via drill 0.5)
  Top 0.254: IC1.42 19.56,10.42 19.81,10.41 v17.27,10.41 | v13.21,4.83 12.84,4.83 R12.2
  Bottom 0.254: v17.27,10.41 15.49,10.16 14.99,9.65 14.99,8.13 13.97,7.11 13.97,6.35 13.21,5.59 v13.21,4.83
RESET
  Top 0.254: IC1.7 19.31,18.54 18.8,19.05 16.76,19.05 15.24,20.57 JP8.1 15.49,21.84 15.49,22.35 17.39,24.25 C11.1 18.8,25.52 18.8,26.92 17.92,27.8 R16.1
RFM1CS  (via drill 0.5)
  Top 0.254: IC1.25 16.76,6.21 v16.76,8.13
  Bottom 0.254: v16.76,8.13 16.76,8.38 19.05,10.67 19.05,11.94 19.8,12.68 U$1.13
RFM1IRQ  (via drill 0.5)
  Top 0.254: IC1.2 21.84,15.2 21.84,16.26 v22.35,16.76
  Bottom 0.254: v22.35,16.76 22.35,15.24 21.8,14.68 U$1.14
RFM2CS  (via drill 0.5)
  Top 0.254: IC1.4 20.81,17.25 23.62,20.07 23.62,21.34 22.61,22.35 22.61,23.62 20.07,26.16 20.07,28.19 v19.05,29.21
  Bottom 0.254: v19.05,29.21 20.69,29.21 U$2.13
RFM2IRQ  (via drill 0.5)
  Top 0.254: IC1.3 21.31,16.99 24.13,19.81 24.13,21.59 23.11,22.61 23.11,23.88 20.57,26.42 20.57,28.7 21.08,29.21 v22.61,29.21
  Bottom 0.254: v22.61,29.21 22.35,30.23 21.64,30.94 20.7,30.94 U$2.14
RX
  Top 0.254: IC1.31 19.81,5.34 19.81,5.33 19.55,3.81 JP5.4
SCK  (via drill 0.5)
  Top 0.254: IC1.26 17.31,7.4 17.53,7.62 17.53,7.87 v17.78,8.13
  Bottom 0.254: v17.78,8.13 17.78,8.64 19.81,10.67 20.69,10.67 U$1.12 | 20.72,10.67 21.59,11.18 21.84,11.18 22.35,11.68 22.35,13.21 24.64,14.99 24.64,26.42 23.88,27.18 23.88,27.19 U$2.12
  Bottom 0.406: 20.72,10.67 U$1.12
SCL  (via drill 0.5)
  Top 0.254: IC1.21 16.53,9.42 16.76,9.65 17.78,9.65 18.03,9.91 21.84,9.91 v22.61,9.65 | U1.23 26.16,9.4 v25.91,9.65 25.4,9.65 25.15,9.4 25.15,8.13 25.4,7.87 26.67,7.87 26.92,7.62 26.92,6.6 27.43,6.1 30.48,6.1 30.99,5.59 30.99,4.32 31.24,4.06 31.24,1.27 32,0.51 33.78,0.51 JP4.3 R13.1
  Bottom 0.254: v22.61,9.65 v25.91,9.65
SDA  (via drill 0.5)
  Top 0.254: IC1.22 15.09,8.89 16.76,8.89 17.02,9.14 18.03,9.14 18.29,9.4 21.59,9.4 v22.35,8.64 | v25.91,8.64 26.16,8.89 U1.24 27.43,8.84 27.43,6.86 27.69,6.6 30.73,6.6 31.5,5.84 31.5,4.57 32.51,3.56 R14.1 JP4.2
  Bottom 0.254: v22.35,8.64 v25.91,8.64
TX
  Top 0.254: JP5.5 22.86,0.51 20.83,0.51 20.32,1.02 20.32,2.29 18.8,3.81 19.3,5.33 IC1.30
VCC
  Top 0.254: 11.18,33.53 D1.A | 6.35,33.53 6.48,33.4
  Top 0.305: 6.6,33.53 11.18,33.53 | 6.35,33.53 6.35,35.81 6.6,36.07 8.64,36.07 9.14,35.56 9.14,33.78 10.16,33.78
  Top 0.406: JP2.12 5.33,32.26 6.48,33.4 6.6,33.53
  Top 0.813: JP6.2 JP2.1 JP2.2 JP2.3 JP2.4 JP2.5 JP2.6 JP2.7 JP2.8 JP2.9 JP2.10 JP2.11 JP2.12

### Text on the board
tNames: EXTCAP | BOOT0 | beta_v0 | RESET | SERIAL | I2C
bNames: AIN5 | AIN4 | https://github.com/kh4/openLRSngRX32 | PWM1...12 | PPM